# Altium schematic sheet AMS1117-3.3.schdoc
size 57 x 37 mm
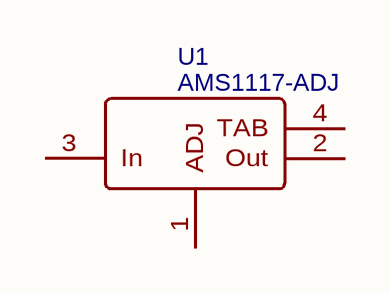
[diagram p0: AMS1117-3.3.schdoc]

## Parts
U1  AMS1117-ADJ  [SOT-223_L6.7-W3.5-P2.30-BR]

## Nets

Not connected (* = marked no-connect by the designer): U1 1(ADJ) 2(Out) 3(In) 4(TAB)

## Library data of the parts
U1 = AMS1117-ADJ: BOM_Manufacturer: AMS; sourceId: 0btnFXRxP; Contributor: GerryChen; SMT Type: Extend; BOM_Supplier: LCSC; BOM_Manufacturer Part: AMS1117-ADJ; image: //image.lceda.cn/szlcsc/C6188.jpg; BOM_Supplier Part: C6188; BOM_JLCPCB SMD: Yes; spicePre: U; spiceSymbolName: AMS1117-ADJ